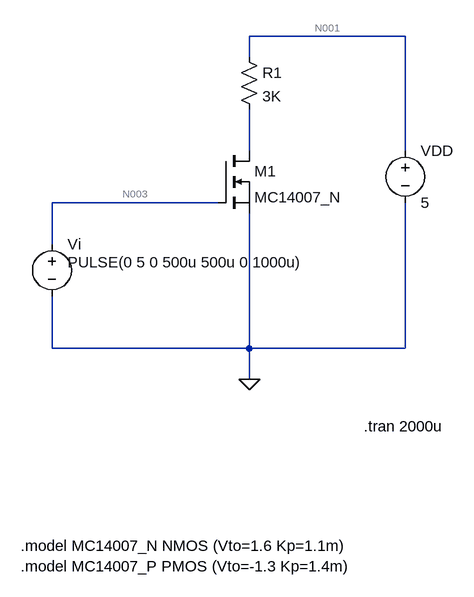
[diagram p0: schematic 123.asc]
123.asc, the LTspice schematic file:
Version 4.1
SHEET 1 880 680
WIRE 608 -176 368 -176
WIRE 368 -144 368 -176
WIRE 368 0 368 -64
WIRE 608 0 608 -176
WIRE 320 80 64 80
WIRE 64 144 64 80
WIRE 64 304 64 224
WIRE 368 304 368 96
WIRE 368 304 64 304
WIRE 608 304 608 80
WIRE 608 304 368 304
WIRE 368 352 368 304
FLAG 368 352 0
SYMBOL voltage 64 128 R0
WINDOW 123 0 0 Left 0
WINDOW 39 0 0 Left 0
WINDOW 3 24 44 Left 2
SYMATTR InstName Vi
SYMATTR Value PULSE(0 5 0 500u 500u 0 1000u)
SYMBOL voltage 608 -16 R0
WINDOW 123 0 0 Left 0
WINDOW 39 0 0 Left 0
SYMATTR InstName VDD
SYMATTR Value 5
SYMBOL nmos 320 0 R0
SYMATTR InstName M1
SYMATTR Value MC14007_N
SYMBOL res 352 -160 R0
SYMATTR InstName R1
SYMATTR Value 3K
TEXT 16 608 Left 2 !.model MC14007_N NMOS (Vto=1.6 Kp=1.1m)\n.model MC14007_P PMOS (Vto=-1.3 Kp=1.4m)
TEXT 544 424 Left 2 !.tran 2000u

The netlist it stands for:
* 123.asc
Vi N003 0 PULSE(0 5 0 500u 500u 0 1000u)
VDD N001 0 5
M1 N002 N003 0 0 MC14007_N
R1 N001 N002 3K
.model NMOS NMOS
.model PMOS PMOS
.lib standard.mos
.model MC14007_N NMOS (Vto=1.6 Kp=1.1m)
.model MC14007_P PMOS (Vto=-1.3 Kp=1.4m)
.tran 2000u
.backanno
.end

* Results of the author's LTspice run, read from the files saved beside the schematic
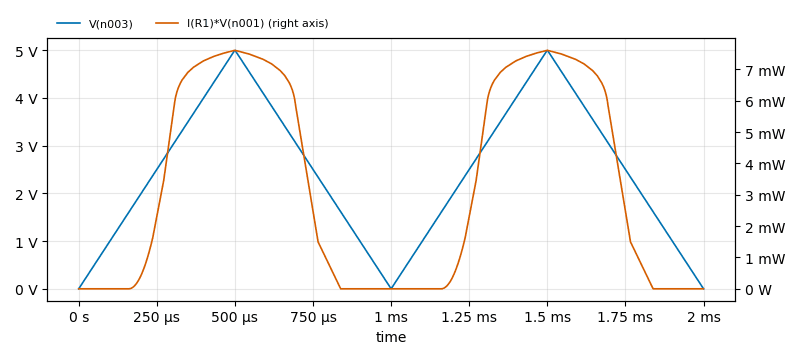
[diagram p1: Transient Analysis of 123.asc, plotted from the saved traces]
* Transient Analysis, 1 run:
*   V(n003): min 0 V, max 4.994 V, average 2.5 V, rms 2.91 V, last 0 V
*   I(R1)*V(n001): min 0 W, max 7.608 mW, average 3.388 mW, rms 4.739 mW, last 0 W